# Altium project Control_Board.PrjPcb (part 7 of 7)

## Sheet DC_Link_Sensing.SchDoc
size A4; SheetNumber: 9; SheetTotal: 9
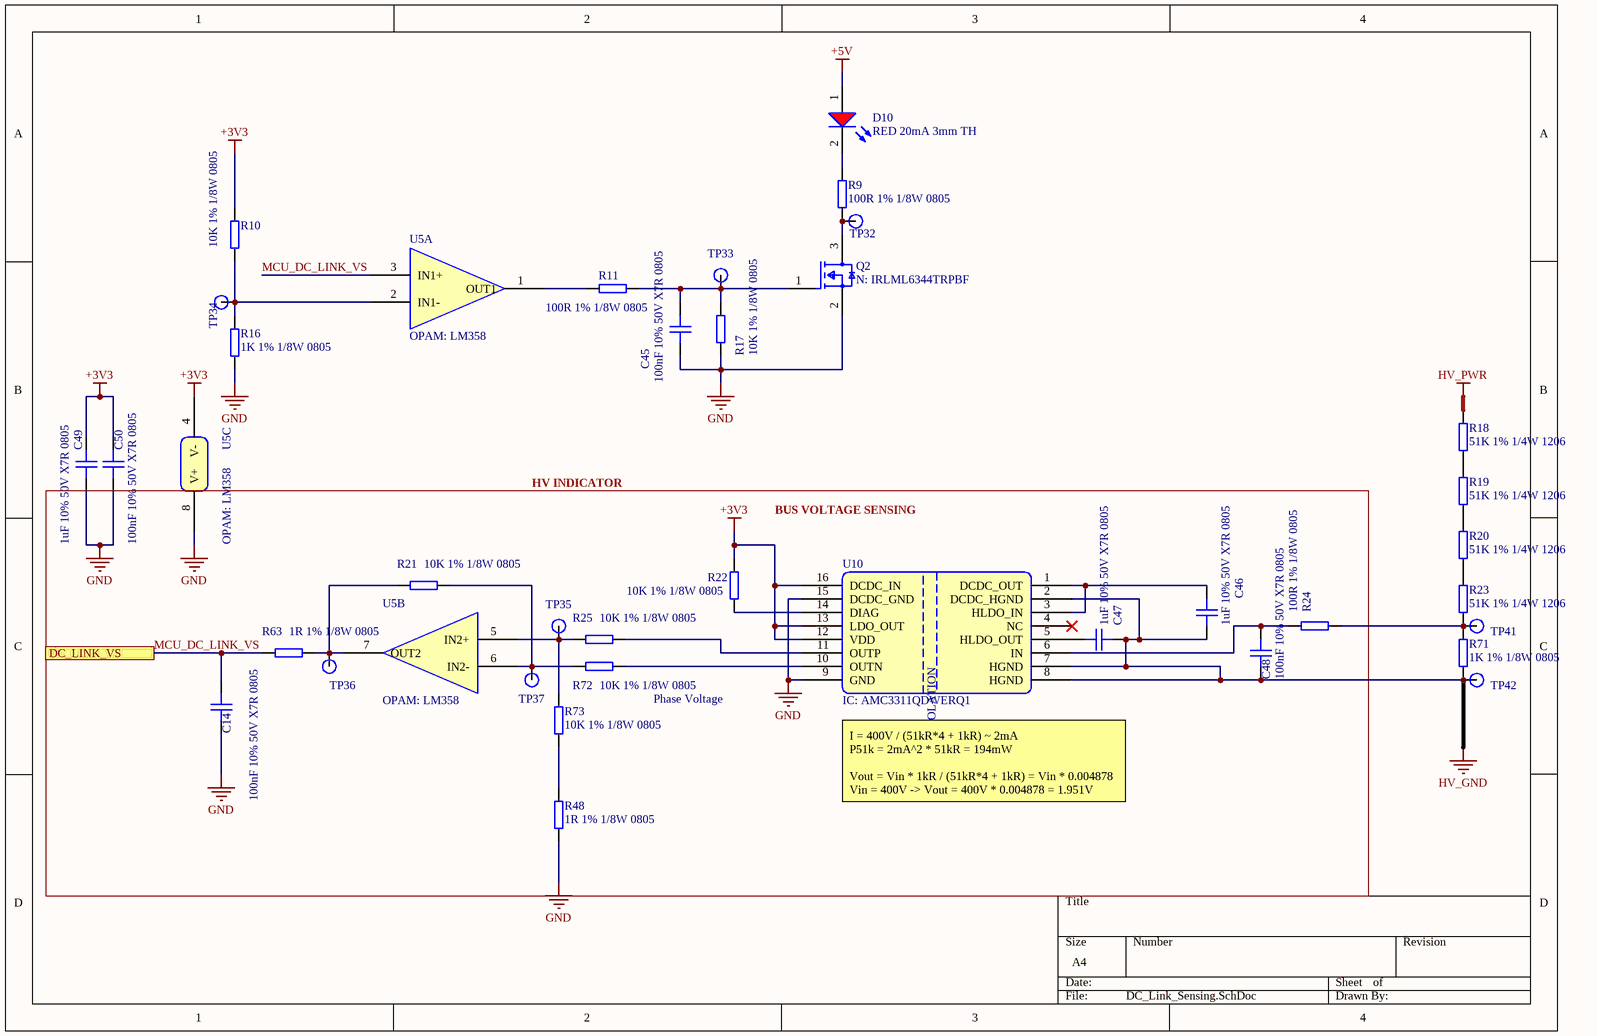
[diagram p8: DC_Link_Sensing.SchDoc]

### Parts
C14  100nF 10% 50V X7R 0805  [CAPC2012X10N]
C45  100nF 10% 50V X7R 0805  [CAPC2012X10N]
C46  1uF 10% 50V X7R 0805  [CAPC2012X10N]
C47  1uF 10% 50V X7R 0805  [CAPC2012X10N]
C48  100nF 10% 50V X7R 0805  [CAPC2012X10N]
C49  1uF 10% 50V X7R 0805  [CAPC2012X10N]
C50  100nF 10% 50V X7R 0805  [CAPC2012X10N]
D10  RED 20mA 3mm TH  [WL-TMRC_D3.95H5.3]
Q2  N: IRLML6344TRPBF  [FP-SOT23-MFG]
R9  100R 1% 1/8W 0805  [RESC2012X05N]
R10  10K 1% 1/8W 0805  [RESC2012X05N]
R11  100R 1% 1/8W 0805  [RESC2012X05N]
R16  1K 1% 1/8W 0805  [RESC2012X05N]
R17  10K 1% 1/8W 0805  [RESC2012X05N]
R18  51K 1% 1/4W 1206  [RESC3116X06N]
R19  51K 1% 1/4W 1206  [RESC3116X06N]
R20  51K 1% 1/4W 1206  [RESC3116X06N]
R21  10K 1% 1/8W 0805  [RESC2012X05N]
R22  10K 1% 1/8W 0805  [RESC2012X05N]
R23  51K 1% 1/4W 1206  [RESC3116X06N]
R24  100R 1% 1/8W 0805  [RESC2012X05N]
R25  10K 1% 1/8W 0805  [RESC2012X05N]
R48  1R 1% 1/8W 0805  [RESC2012X05N]
R63  1R 1% 1/8W 0805  [RESC2012X05N]
R71  1K 1% 1/8W 0805  [RESC2012X05N]
R72  10K 1% 1/8W 0805  [RESC2012X05N]
R73  10K 1% 1/8W 0805  [RESC2012X05N]
TP32  TestPoint  [Test Point-Footprint-1]  (value not drawn)
TP33  TestPoint  [Test Point-Footprint-1]  (value not drawn)
TP34  TestPoint  [Test Point-Footprint-1]  (value not drawn)
TP35  TestPoint  [Test Point-Footprint-1]  (value not drawn)
TP36  TestPoint  [Test Point-Footprint-1]  (value not drawn)
TP37  TestPoint  [Test Point-Footprint-1]  (value not drawn)
TP41  TestPoint  [Test Point-Footprint-1]  (value not drawn)
TP42  TestPoint  [Test Point-Footprint-1]  (value not drawn)
U5  OPAM: LM358  [FP-D0008A-IPC_C]  (parts A,B,C of 3)
U10  IC: AMC3311QDWERQ1  [SOIC127P1030X265-16N]

### Ports
DC_LINK_VS (see Control_Board_SCH[3C], Microcontroller[4B])

### Nets
+3V3: C49.2 C50.2 R10.2 R22.1 U5.4(V-) U10.12(VDD) U10.13(LDO_OUT) U10.16(DCDC_IN)
+5V: D10.1(A)
GND: C14.1 C45.1 C49.1 C50.1 Q2.2(S) R16.1 R17.1 R48.1 U5.8(V+) U10.9(GND) U10.15(DCDC_GND)
HV_GND: C46.1 C47.1 C48.1 R71.1 TP42.1 U10.2(DCDC_HGND) U10.7(HGND) U10.8(HGND)
HV_PWR: R18.2
MCU_DC_LINK_VS: C14.2 R63.1 U5.3(IN1+) ; port DC_LINK_VS
NetC45_2: C45.2 Q2.1(G) R11.2 R17.2 TP33.1
NetC46_2: C46.2 U10.1(DCDC_OUT) U10.3(HLDO_IN)
NetC47_2: C47.2 U10.5(HLDO_OUT)
NetC48_2: C48.2 R24.2 U10.6(IN)
NetD10_2: D10.2(K) R9.2
NetQ2_3: Q2.3(D) R9.1 TP32.1
NetR10_1: R10.1 R16.2 TP34.1 U5.2(IN1-)
NetR11_1: R11.1 U5.1(OUT1)
NetR18_1: R18.1 R19.2
NetR19_1: R19.1 R20.2
NetR20_1: R20.1 R23.2
NetR21_1: R21.1 R63.2 TP36.1 U5.7(OUT2)
NetR21_2: R21.2 R72.1 TP37.1 U5.6(IN2-)
NetR22_2: R22.2 U10.14(DIAG)
NetR23_1: R23.1 R24.1 R71.2 TP41.1
NetR25_1: R25.1 R73.2 TP35.1 U5.5(IN2+)
NetR25_2: R25.2 U10.11(OUTP)
NetR48_2: R48.2 R73.1
NetR72_2: R72.2 U10.10(OUTN)

Not connected (* = marked no-connect by the designer): U10 4(NC)*

### Notes on the sheet
- HV INDICATOR
- BUS VOLTAGE SENSING
- Phase Voltage
- (near U10) I = 400V / (51kR*4 + 1kR) ~ 2mA
  P51k = 2mA^2 * 51kR = 194mW
  Vout = Vin * 1kR / (51kR*4 + 1kR) = Vin * 0.004878
  Vin = 400V -> Vout = 400V * 0.004878 = 1.951V
- (in symbol CMP-001-00097-4) ISOLATION

### Library data of the parts
C14 C45 C48 C50 = CMP-001-00091-1: Multilayer Ceramic Capacitors MLCC - SMD/SMT 50V 0.1uF X7R 0805 10%; Manufacturer: Stackpole Electronics; Manufacturer Part Number: CML0805X7R104KT50V; Voltage Rating (DC): 50V; REACH SVHC: Yes; Height: 800µm; Min Operating Temperature: -55°C; Dielectric Material: Ceramic; RoHS: Compliant; Number of Terminals: 2; Lifecycle Status: Production; Width: 1.25mm; Length: 2mm; Category: Ceramic Capacitors; Max Operating Temperature: 125°C; Mount: Surface Mount; Capacitance: 100nF
C46 C47 C49 = CMP-001-00047-1: Ceramic Capacitor, Multilayer, Ceramic, 50V, 10% +Tol, 10% -Tol, X7R, 15% TC, 1uF, Surface Mount, 0805; Manufacturer Part Number: C2012X7R1H105K125AB; Manufacturer Lifecycle Status: PRODUCTION; Manufacturer: TDK; Value: 1µF; Export Control Classification Number (ECCN) Code: EAR99; Case/Package: 0805; Max Length: 3.5mm; ComponentLink4Description: https://datasheet.octopart.com:443/C3216X7R1H106K160AC-TDK-datasheet-151546523.pdf?src-supplier=ODG+(Origin+Data+Global); ComponentLink1URL: https://datasheet.octopart.com:443/C3216X7R1H106K160AC-TDK-datasheet-175423548.pdf?src-supplier=TME; Category: Ceramic Capacitors; Voltage Rating (DC): 50V; Case Code (Metric): 2012; Lifecycle Status: Production; Height: 1.6mm; Design Item ID: 1uF 10% 50V X7R 0805; Min Length: 3.1mm; Min Operating Temperature: -55°C; Pricing: 100=3,09, 250=2,81, 500=2,35, 1000=2,2, 2000=1,97 (DKK); Width: 1.6mm; Voltage Rating: 50V; Stock: 26276; ComponentLink2Description: https://datasheet.octopart.com:443/C3216X7R1H106K160AC-TDK-datasheet-182135025.pdf?src-supplier=TME; Harmonized Tariff Schedule (HTS) Code: 8532.24.00.20; ComponentLink3Description: https://datasheet.octopart.com:443/C3216X7R1H106K160AC-TDK-datasheet-159617022.pdf?src-supplier=TME; Thickness: 1.6mm; Max Operating Temperature: 125°C; ComponentLink4URL: https://datasheet.octopart.com:443/C3216X7R1H106K160AC-TDK-datasheet-151546523.pdf?src-supplier=ODG+(Origin+Data+Global); Lead Free: Lead Free; ComponentLink3URL: https://datasheet.octopart.com:443/C3216X7R1H106K160AC-TDK-datasheet-159617022.pdf?src-supplier=TME; ComponentLink1Description: https://datasheet.octopart.com:443/C3216X7R1H106K160AC-TDK-datasheet-175423548.pdf?src-supplier=TME; Max Width: 1.9mm; Dielectric: X7R; RoHS: Compliant; China RoHS: Compliant; REACH SVHC: Yes; ComponentLink2URL: https://datasheet.octopart.com:443/C3216X7R1H106K160AC-TDK-datasheet-182135025.pdf?src-supplier=TME; Length: 3.2mm; ComponentLink5URL: https://datasheet.octopart.com/C3216X7R1H106K160AC-TDK-datasheet-41194876.pdf; Introduction Date: 2018-03-29; Dielectric Material: Ceramic; Min Width: 1.5mm; Number of Terminals: 2; Material: Ceramic; Source: MasterLibrary_SCH.SchLib; Mounting Technology: Surface Mount; ComponentLink5Description: https://datasheet.octopart.com/C3216X7R1H106K160AC-TDK-datasheet-41194876.pdf
D10 = CMP-007-00005-2: LED RED DIFFUSED 3MM ROUND T/H; Manufacturer: Wurth Elektronik; Manufacturer Part Number: 151031SS06000; Lens Style: Circular, Diffused, Round; Peak Wavelength: 650nm; Dominant Wavelength: 640nm; Max Reverse Voltage (DC): 5V; Luminous Intensity: 35mcd; Forward Voltage: 2.2V; Forward Current: 100mA; Max Operating Temperature: 85°C; Length: 3mm; Category: LEDs; RoHS: Compliant; Lens Size: 3mm; Height: 5.3mm; Test Current: 20mA; Color: Red; Min Operating Temperature: -40°C; Packaging: Bulk; Case/Package: Radial; Mount: Through Hole; REACH SVHC: Unknown
Q2 = CMP-013-00010-1: N-Channel 30 V 5A (Ta) 1.3W (Ta) Surface Mount Micro3™/SOT-23; Manufacturer: Infineon; Manufacturer Package Identifier: Micro3; Gate to Source Voltage (Vgs): 12V; Drain to Source Voltage (Vdss): 30V; Drain to Source Resistance: 29mΩ; Input Capacitance: 650pF; Fall Time: 9.1ns; Element Configuration: Single; Continuous Drain Current (ID): 5A; Lead Free: Lead Free; Height: 1.12mm; Lifecycle Status: Production; Case/Package: SOT-23; Introduction Date: 2010-10-28; Export Control Classification Number (ECCN) Code: EAR99; Drain to Source Breakdown Voltage: 30V; Category: MOSFETs; Manufacturer Part Number: IRLML6344TRPBF; Country of Origin: Mainland China, UK; Length: 3.04mm; Harmonized Tariff Schedule (HTS) Code: 8541.29.00.95
R9 R11 R24 = CMP-009-00668-1: Res Thick Film 0805 100 Ohm 1% 0.125W ±100ppm/°C Molded SMD Paper T/R; Manufacturer Part Number: RMCF0805FT100R; Manufacturer: Stackpole Electronics; Working Voltage: 150V; Power Rating: 125mW; Value: 100; Features: Automotive AEC-Q200; Lifecycle Status: Production; ComponentLink10URL: https://datasheet.octopart.com:443/RMCF0805FT10K0-Stackpole-Electronics-datasheet-11547379.pdf?src-supplier=Future+Electronics; Case Code (Metric): 2012; ComponentLink16URL: http://sigma.octopart.com:80/141158211/reach_statement/Stackpole-Electronics-RMCF0805FT10K0.pdf?src-supplier=Compliance+Statements; ComponentLink14URL: https://datasheet.octopart.com:443/RMCF0805FT10K0-Stackpole-Electronics-datasheet-5313682.pdf?src-supplier=Future+Electronics; ComponentLink6URL: https://datasheet.octopart.com:443/RMCF0805FT10K0-Stackpole-Electronics-datasheet-62091608.pdf?src-supplier=Stackpole+Electronics; ComponentLink3URL: https://datasheet.octopart.com:443/RMCF0805FT10K0-Stackpole-Electronics-datasheet-28504820.pdf?src-supplier=Upverter; Design Item ID: 100R 1% 1/8W 0805; Mounting Technology: Surface Mount; ComponentLink9URL: https://datasheet.octopart.com:443/RMCF0805FT10K0-Stackpole-Electronics-datasheet-11546843.pdf?src-supplier=Arrow+Electronics; ComponentLink2Description: https://datasheet.octopart.com:443/RMCF0805FT10K0-Stackpole-Electronics-datasheet-12534581.pdf?src-supplier=Upverter; Voltage Rating: 150V; ComponentLink17Description: http://sigma.octopart.com:80/141158212/rohs_statement/Stackpole-Electronics-RMCF0805FT10K0.pdf?src-supplier=Compliance+Statements; Stock: 3420000; Number of Terminations: 2; Contact Plating: Tin; ComponentLink1Description: https://datasheet.octopart.com:443/RMCF0805FT10K0-Stackpole-Electronics-datasheet-182148065.pdf?src-supplier=IHS; ComponentLink2URL: https://datasheet.octopart.com:443/RMCF0805FT10K0-Stackpole-Electronics-datasheet-12534581.pdf?src-supplier=Upverter; Source: MasterLibrary_SCH.SchLib; Length: 2mm; ComponentLink13Description: https://datasheet.octopart.com:443/RMCF0805FT10K0-Stackpole-Electronics-datasheet-8088878.pdf?src-supplier=Future+Electronics; Lead Free: Lead Free; Category: Chip SMD Resistors; Composition: Thick Film; Tolerance: 1%; Schedule B: 8533210045, 8533210045; RoHS: Compliant; ComponentLink15URL: http://sigma.octopart.com:80/15940719/materials_sheet/Stackpole-Electronics-RMCF0805FT10K0.pdf?src-supplier=Compliance+Statements; Case/Package: 0805; Pricing: 5000=0.00245, 10000=0.00241, 20000=0.00238, 40000=0.00234, 80000=0.0023 (USD); ComponentLink8Description: https://datasheet.octopart.com:443/RMCF0805FT10K0-Stackpole-Electronics-datasheet-154799224.pdf?src-supplier=Master+Electronics; ComponentLink11Description: https://datasheet.octopart.com:443/RMCF0805FT10K0-Stackpole-Electronics-datasheet-8359789.pdf?src-supplier=Future+Electronics; China RoHS: Non-Compliant; Height: 500µm; ComponentLink9Description: https://datasheet.octopart.com:443/RMCF0805FT10K0-Stackpole-Electronics-datasheet-11546843.pdf?src-supplier=Arrow+Electronics; ComponentLink8URL: https://datasheet.octopart.com:443/RMCF0805FT10K0-Stackpole-Electronics-datasheet-154799224.pdf?src-supplier=Master+Electronics; ComponentLink12Description: https://datasheet.octopart.com:443/RMCF0805FT10K0-Stackpole-Electronics-datasheet-8324226.pdf?src-supplier=Future+Electronics; Temperature Coefficient: 100ppm/°C; ComponentLink12URL: https://datasheet.octopart.com:443/RMCF0805FT10K0-Stackpole-Electronics-datasheet-8324226.pdf?src-supplier=Future+Electronics; Number of Terminals: 2; Depth: 1.25mm; ComponentLink7Description: https://datasheet.octopart.com:443/RMCF0805FT10K0-Stackpole-Electronics-datasheet-10788263.pdf?src-supplier=Stackpole+Electronics; ComponentLink15Description: http://sigma.octopart.com:80/15940719/materials_sheet/Stackpole-Electronics-RMCF0805FT10K0.pdf?src-supplier=Compliance+Statements; ComponentLink6Description: https://datasheet.octopart.com:443/RMCF0805FT10K0-Stackpole-Electronics-datasheet-62091608.pdf?src-supplier=Stackpole+Electronics; Packaging: Cut Tape (CT); Max Operating Temperature: 155°C; ComponentLink7URL: https://datasheet.octopart.com:443/RMCF0805FT10K0-Stackpole-Electronics-datasheet-10788263.pdf?src-supplier=Stackpole+Electronics; ComponentLink16Description: http://sigma.octopart.com:80/141158211/reach_statement/Stackpole-Electronics-RMCF0805FT10K0.pdf?src-supplier=Compliance+Statements; Width: 1.25mm; Power Dissipation: 125mW; ComponentLink5Description: https://datasheet.octopart.com:443/RMCF0805FT10K0-Stackpole-Electronics-datasheet-141193804.pdf?src-supplier=Stackpole+Electronics; Radiation Hardening: No; Military Standard: Not; Min Operating Temperature: -55°C; ComponentLink11URL: https://datasheet.octopart.com:443/RMCF0805FT10K0-Stackpole-Electronics-datasheet-8359789.pdf?src-supplier=Future+Electronics; ComponentLink3Description: https://datasheet.octopart.com:443/RMCF0805FT10K0-Stackpole-Electronics-datasheet-28504820.pdf?src-supplier=Upverter; REACH SVHC: Yes; ComponentLink4Description: https://datasheet.octopart.com:443/RMCF0805FT10K0-Stackpole-Electronics-datasheet-12510902.pdf?src-supplier=Upverter; ComponentLink10Description: https://datasheet.octopart.com:443/RMCF0805FT10K0-Stackpole-Electronics-datasheet-11547379.pdf?src-supplier=Future+Electronics; ComponentLink5URL: https://datasheet.octopart.com:443/RMCF0805FT10K0-Stackpole-Electronics-datasheet-141193804.pdf?src-supplier=Stackpole+Electronics; Max Power Dissipation: 125mW; ComponentLink13URL: https://datasheet.octopart.com:443/RMCF0805FT10K0-Stackpole-Electronics-datasheet-8088878.pdf?src-supplier=Future+Electronics; ComponentLink17URL: http://sigma.octopart.com:80/141158212/rohs_statement/Stackpole-Electronics-RMCF0805FT10K0.pdf?src-supplier=Compliance+Statements; ComponentLink14Description: https://datasheet.octopart.com:443/RMCF0805FT10K0-Stackpole-Electronics-datasheet-5313682.pdf?src-supplier=Future+Electronics; ComponentLink4URL: https://datasheet.octopart.com:443/RMCF0805FT10K0-Stackpole-Electronics-datasheet-12510902.pdf?src-supplier=Upverter; ComponentLink1URL: https://datasheet.octopart.com:443/RMCF0805FT10K0-Stackpole-Electronics-datasheet-182148065.pdf?src-supplier=IHS
R10 R21 R22 R25 R72 R73 = CMP-009-00659-2: Res Thick Film 0805 10K Ohm 1% 0.125W ±100ppm/°C Molded SMD Paper T/R; Manufacturer: Stackpole Electronics; Manufacturer Part Number: RMCF0805FT10K0; Power Dissipation: 125mW; Voltage Rating: 150V; Design Item ID: 10K 1% 1/4W 0805; ComponentLink15URL: http://sigma.octopart.com:80/15940719/materials_sheet/Stackpole-Electronics-RMCF0805FT10K0.pdf?src-supplier=Compliance+Statements; ComponentLink13Description: https://datasheet.octopart.com:443/RMCF0805FT10K0-Stackpole-Electronics-datasheet-8088878.pdf?src-supplier=Future+Electronics; Depth: 1.25mm; Number of Terminations: 2; ComponentLink12Description: https://datasheet.octopart.com:443/RMCF0805FT10K0-Stackpole-Electronics-datasheet-8324226.pdf?src-supplier=Future+Electronics; ComponentLink9URL: https://datasheet.octopart.com:443/RMCF0805FT10K0-Stackpole-Electronics-datasheet-11546843.pdf?src-supplier=Arrow+Electronics; ComponentLink4Description: https://datasheet.octopart.com:443/RMCF0805FT10K0-Stackpole-Electronics-datasheet-12510902.pdf?src-supplier=Upverter; China RoHS: Non-Compliant; Contact Plating: Tin; ComponentLink7URL: https://datasheet.octopart.com:443/RMCF0805FT10K0-Stackpole-Electronics-datasheet-10788263.pdf?src-supplier=Stackpole+Electronics; ComponentLink6Description: https://datasheet.octopart.com:443/RMCF0805FT10K0-Stackpole-Electronics-datasheet-62091608.pdf?src-supplier=Stackpole+Electronics; ComponentLink4URL: https://datasheet.octopart.com:443/RMCF0805FT10K0-Stackpole-Electronics-datasheet-12510902.pdf?src-supplier=Upverter; ComponentLink12URL: https://datasheet.octopart.com:443/RMCF0805FT10K0-Stackpole-Electronics-datasheet-8324226.pdf?src-supplier=Future+Electronics; ComponentLink1Description: https://datasheet.octopart.com:443/RMCF0805FT10K0-Stackpole-Electronics-datasheet-182148065.pdf?src-supplier=IHS; ComponentLink3URL: https://datasheet.octopart.com:443/RMCF0805FT10K0-Stackpole-Electronics-datasheet-28504820.pdf?src-supplier=Upverter; Width: 1.25mm; Lifecycle Status: Production; ComponentLink15Description: http://sigma.octopart.com:80/15940719/materials_sheet/Stackpole-Electronics-RMCF0805FT10K0.pdf?src-supplier=Compliance+Statements; Max Operating Temperature: 155°C; ComponentLink8URL: https://datasheet.octopart.com:443/RMCF0805FT10K0-Stackpole-Electronics-datasheet-154799224.pdf?src-supplier=Master+Electronics; ComponentLink16URL: http://sigma.octopart.com:80/141158211/reach_statement/Stackpole-Electronics-RMCF0805FT10K0.pdf?src-supplier=Compliance+Statements; ComponentLink3Description: https://datasheet.octopart.com:443/RMCF0805FT10K0-Stackpole-Electronics-datasheet-28504820.pdf?src-supplier=Upverter; ComponentLink10URL: https://datasheet.octopart.com:443/RMCF0805FT10K0-Stackpole-Electronics-datasheet-11547379.pdf?src-supplier=Future+Electronics; Features: Automotive AEC-Q200; Lead Free: Lead Free; ComponentLink2Description: https://datasheet.octopart.com:443/RMCF0805FT10K0-Stackpole-Electronics-datasheet-12534581.pdf?src-supplier=Upverter; ComponentLink14Description: https://datasheet.octopart.com:443/RMCF0805FT10K0-Stackpole-Electronics-datasheet-5313682.pdf?src-supplier=Future+Electronics; ComponentLink17URL: http://sigma.octopart.com:80/141158212/rohs_statement/Stackpole-Electronics-RMCF0805FT10K0.pdf?src-supplier=Compliance+Statements; Stock: 3420000; ComponentLink5URL: https://datasheet.octopart.com:443/RMCF0805FT10K0-Stackpole-Electronics-datasheet-141193804.pdf?src-supplier=Stackpole+Electronics; ComponentLink11URL: https://datasheet.octopart.com:443/RMCF0805FT10K0-Stackpole-Electronics-datasheet-8359789.pdf?src-supplier=Future+Electronics; Max Power Dissipation: 125mW; ComponentLink10Description: https://datasheet.octopart.com:443/RMCF0805FT10K0-Stackpole-Electronics-datasheet-11547379.pdf?src-supplier=Future+Electronics; Case/Package: 0805; ComponentLink8Description: https://datasheet.octopart.com:443/RMCF0805FT10K0-Stackpole-Electronics-datasheet-154799224.pdf?src-supplier=Master+Electronics; Schedule B: 8533210045, 8533210045; Composition: Thick Film; RoHS: Compliant; ComponentLink17Description: http://sigma.octopart.com:80/141158212/rohs_statement/Stackpole-Electronics-RMCF0805FT10K0.pdf?src-supplier=Compliance+Statements; Case Code (Metric): 2012; Number of Terminals: 2; Military Standard: Not; ComponentLink11Description: https://datasheet.octopart.com:443/RMCF0805FT10K0-Stackpole-Electronics-datasheet-8359789.pdf?src-supplier=Future+Electronics; Height: 500µm; Min Operating Temperature: -55°C; Category: Chip SMD Resistors; Value: 10k; Working Voltage: 150V; Source: MasterLibrary_SCH.SchLib; ComponentLink5Description: https://datasheet.octopart.com:443/RMCF0805FT10K0-Stackpole-Electronics-datasheet-141193804.pdf?src-supplier=Stackpole+Electronics; Length: 2mm; ComponentLink16Description: http://sigma.octopart.com:80/141158211/reach_statement/Stackpole-Electronics-RMCF0805FT10K0.pdf?src-supplier=Compliance+Statements; Tolerance: 1%; Temperature Coefficient: 100ppm/°C; Pricing: 5000=0.00245, 10000=0.00241, 20000=0.00238, 40000=0.00234, 80000=0.0023 (USD); REACH SVHC: Yes; Mounting Technology: Surface Mount; Packaging: Cut Tape (CT); ComponentLink9Description: https://datasheet.octopart.com:443/RMCF0805FT10K0-Stackpole-Electronics-datasheet-11546843.pdf?src-supplier=Arrow+Electronics; Power Rating: 125mW; ComponentLink13URL: https://datasheet.octopart.com:443/RMCF0805FT10K0-Stackpole-Electronics-datasheet-8088878.pdf?src-supplier=Future+Electronics; ComponentLink2URL: https://datasheet.octopart.com:443/RMCF0805FT10K0-Stackpole-Electronics-datasheet-12534581.pdf?src-supplier=Upverter; ComponentLink1URL: https://datasheet.octopart.com:443/RMCF0805FT10K0-Stackpole-Electronics-datasheet-182148065.pdf?src-supplier=IHS; ComponentLink7Description: https://datasheet.octopart.com:443/RMCF0805FT10K0-Stackpole-Electronics-datasheet-10788263.pdf?src-supplier=Stackpole+Electronics; Radiation Hardening: No; ComponentLink6URL: https://datasheet.octopart.com:443/RMCF0805FT10K0-Stackpole-Electronics-datasheet-62091608.pdf?src-supplier=Stackpole+Electronics; ComponentLink14URL: https://datasheet.octopart.com:443/RMCF0805FT10K0-Stackpole-Electronics-datasheet-5313682.pdf?src-supplier=Future+Electronics
R16 R71 = CMP-009-00648-1: Res Thick Film 0805 1K Ohm 1% 0.125W ±100ppm/°C Molded SMD Paper T/R; Manufacturer: Stackpole Electronics; Manufacturer Part Number: RMCF0805FT1K00; Power Dissipation: 125mW; Working Voltage: 150V; ComponentLink4Description: https://datasheet.octopart.com:443/RMCF0805FT10K0-Stackpole-Electronics-datasheet-12510902.pdf?src-supplier=Upverter; Tolerance: 1%; ComponentLink7Description: https://datasheet.octopart.com:443/RMCF0805FT10K0-Stackpole-Electronics-datasheet-10788263.pdf?src-supplier=Stackpole+Electronics; Category: Chip SMD Resistors; Pricing: 5000=0.00245, 10000=0.00241, 20000=0.00238, 40000=0.00234, 80000=0.0023 (USD); RoHS: Compliant; Packaging: Cut Tape (CT); Width: 1.25mm; ComponentLink12URL: https://datasheet.octopart.com:443/RMCF0805FT10K0-Stackpole-Electronics-datasheet-8324226.pdf?src-supplier=Future+Electronics; Temperature Coefficient: 100ppm/°C; Lifecycle Status: Production; Mounting Technology: Surface Mount; ComponentLink6Description: https://datasheet.octopart.com:443/RMCF0805FT10K0-Stackpole-Electronics-datasheet-62091608.pdf?src-supplier=Stackpole+Electronics; Number of Terminals: 2; ComponentLink1Description: https://datasheet.octopart.com:443/RMCF0805FT10K0-Stackpole-Electronics-datasheet-182148065.pdf?src-supplier=IHS; REACH SVHC: Yes; ComponentLink4URL: https://datasheet.octopart.com:443/RMCF0805FT10K0-Stackpole-Electronics-datasheet-12510902.pdf?src-supplier=Upverter; Power Rating: 125mW; Value: 1k; ComponentLink13URL: https://datasheet.octopart.com:443/RMCF0805FT10K0-Stackpole-Electronics-datasheet-8088878.pdf?src-supplier=Future+Electronics; ComponentLink10Description: https://datasheet.octopart.com:443/RMCF0805FT10K0-Stackpole-Electronics-datasheet-11547379.pdf?src-supplier=Future+Electronics; ComponentLink12Description: https://datasheet.octopart.com:443/RMCF0805FT10K0-Stackpole-Electronics-datasheet-8324226.pdf?src-supplier=Future+Electronics; ComponentLink2Description: https://datasheet.octopart.com:443/RMCF0805FT10K0-Stackpole-Electronics-datasheet-12534581.pdf?src-supplier=Upverter; Number of Terminations: 2; ComponentLink17URL: http://sigma.octopart.com:80/141158212/rohs_statement/Stackpole-Electronics-RMCF0805FT10K0.pdf?src-supplier=Compliance+Statements; Contact Plating: Tin; ComponentLink9URL: https://datasheet.octopart.com:443/RMCF0805FT10K0-Stackpole-Electronics-datasheet-11546843.pdf?src-supplier=Arrow+Electronics; ComponentLink17Description: http://sigma.octopart.com:80/141158212/rohs_statement/Stackpole-Electronics-RMCF0805FT10K0.pdf?src-supplier=Compliance+Statements; ComponentLink2URL: https://datasheet.octopart.com:443/RMCF0805FT10K0-Stackpole-Electronics-datasheet-12534581.pdf?src-supplier=Upverter; Case Code (Metric): 2012; ComponentLink8Description: https://datasheet.octopart.com:443/RMCF0805FT10K0-Stackpole-Electronics-datasheet-154799224.pdf?src-supplier=Master+Electronics; ComponentLink11Description: https://datasheet.octopart.com:443/RMCF0805FT10K0-Stackpole-Electronics-datasheet-8359789.pdf?src-supplier=Future+Electronics; ComponentLink5Description: https://datasheet.octopart.com:443/RMCF0805FT10K0-Stackpole-Electronics-datasheet-141193804.pdf?src-supplier=Stackpole+Electronics; ComponentLink11URL: https://datasheet.octopart.com:443/RMCF0805FT10K0-Stackpole-Electronics-datasheet-8359789.pdf?src-supplier=Future+Electronics; Height: 500µm; ComponentLink1URL: https://datasheet.octopart.com:443/RMCF0805FT10K0-Stackpole-Electronics-datasheet-182148065.pdf?src-supplier=IHS; Length: 2mm; ComponentLink16Description: http://sigma.octopart.com:80/141158211/reach_statement/Stackpole-Electronics-RMCF0805FT10K0.pdf?src-supplier=Compliance+Statements; ComponentLink6URL: https://datasheet.octopart.com:443/RMCF0805FT10K0-Stackpole-Electronics-datasheet-62091608.pdf?src-supplier=Stackpole+Electronics; Schedule B: 8533210045, 8533210045; ComponentLink14URL: https://datasheet.octopart.com:443/RMCF0805FT10K0-Stackpole-Electronics-datasheet-5313682.pdf?src-supplier=Future+Electronics; Stock: 3420000; ComponentLink14Description: https://datasheet.octopart.com:443/RMCF0805FT10K0-Stackpole-Electronics-datasheet-5313682.pdf?src-supplier=Future+Electronics; Features: Automotive AEC-Q200; China RoHS: Non-Compliant; ComponentLink13Description: https://datasheet.octopart.com:443/RMCF0805FT10K0-Stackpole-Electronics-datasheet-8088878.pdf?src-supplier=Future+Electronics; Voltage Rating: 150V; Radiation Hardening: No; Source: MasterLibrary_SCH.SchLib; ComponentLink8URL: https://datasheet.octopart.com:443/RMCF0805FT10K0-Stackpole-Electronics-datasheet-154799224.pdf?src-supplier=Master+Electronics; Max Operating Temperature: 155°C; Design Item ID: 1K 1% 1/8W 0805; ComponentLink15Description: http://sigma.octopart.com:80/15940719/materials_sheet/Stackpole-Electronics-RMCF0805FT10K0.pdf?src-supplier=Compliance+Statements; ComponentLink5URL: https://datasheet.octopart.com:443/RMCF0805FT10K0-Stackpole-Electronics-datasheet-141193804.pdf?src-supplier=Stackpole+Electronics; ComponentLink15URL: http://sigma.octopart.com:80/15940719/materials_sheet/Stackpole-Electronics-RMCF0805FT10K0.pdf?src-supplier=Compliance+Statements; Lead Free: Lead Free; Case/Package: 0805; Max Power Dissipation: 125mW; ComponentLink10URL: https://datasheet.octopart.com:443/RMCF0805FT10K0-Stackpole-Electronics-datasheet-11547379.pdf?src-supplier=Future+Electronics; ComponentLink7URL: https://datasheet.octopart.com:443/RMCF0805FT10K0-Stackpole-Electronics-datasheet-10788263.pdf?src-supplier=Stackpole+Electronics; Min Operating Temperature: -55°C; ComponentLink9Description: https://datasheet.octopart.com:443/RMCF0805FT10K0-Stackpole-Electronics-datasheet-11546843.pdf?src-supplier=Arrow+Electronics; Depth: 1.25mm; Military Standard: Not; ComponentLink16URL: http://sigma.octopart.com:80/141158211/reach_statement/Stackpole-Electronics-RMCF0805FT10K0.pdf?src-supplier=Compliance+Statements; ComponentLink3URL: https://datasheet.octopart.com:443/RMCF0805FT10K0-Stackpole-Electronics-datasheet-28504820.pdf?src-supplier=Upverter; ComponentLink3Description: https://datasheet.octopart.com:443/RMCF0805FT10K0-Stackpole-Electronics-datasheet-28504820.pdf?src-supplier=Upverter; Composition: Thick Film
R17 = CMP-009-00659-2: Res Thick Film 0805 10K Ohm 1% 0.125W ±100ppm/°C Molded SMD Paper T/R; Manufacturer Part Number: RMCF0805FT10K0; Manufacturer: Stackpole Electronics; Power Rating: 125mW; Working Voltage: 150V; ComponentLink17Description: http://sigma.octopart.com:80/141158212/rohs_statement/Stackpole-Electronics-RMCF0805FT10K0.pdf?src-supplier=Compliance+Statements; Military Standard: Not; ComponentLink2Description: https://datasheet.octopart.com:443/RMCF0805FT10K0-Stackpole-Electronics-datasheet-12534581.pdf?src-supplier=Upverter; Power Dissipation: 125mW; Radiation Hardening: No; Min Operating Temperature: -55°C; Mounting Technology: Surface Mount; Pricing: 5000=0.00245, 10000=0.00241, 20000=0.00238, 40000=0.00234, 80000=0.0023 (USD); ComponentLink9Description: https://datasheet.octopart.com:443/RMCF0805FT10K0-Stackpole-Electronics-datasheet-11546843.pdf?src-supplier=Arrow+Electronics; Temperature Coefficient: 100ppm/°C; Contact Plating: Tin; Number of Terminals: 2; Source: MasterLibrary_SCH.SchLib; ComponentLink16URL: http://sigma.octopart.com:80/141158211/reach_statement/Stackpole-Electronics-RMCF0805FT10K0.pdf?src-supplier=Compliance+Statements; ComponentLink10Description: https://datasheet.octopart.com:443/RMCF0805FT10K0-Stackpole-Electronics-datasheet-11547379.pdf?src-supplier=Future+Electronics; Case/Package: 0805; RoHS: Compliant; ComponentLink14Description: https://datasheet.octopart.com:443/RMCF0805FT10K0-Stackpole-Electronics-datasheet-5313682.pdf?src-supplier=Future+Electronics; Max Power Dissipation: 125mW; ComponentLink7URL: https://datasheet.octopart.com:443/RMCF0805FT10K0-Stackpole-Electronics-datasheet-10788263.pdf?src-supplier=Stackpole+Electronics; Number of Terminations: 2; Tolerance: 1%; Stock: 3420000; ComponentLink3Description: https://datasheet.octopart.com:443/RMCF0805FT10K0-Stackpole-Electronics-datasheet-28504820.pdf?src-supplier=Upverter; REACH SVHC: Yes; ComponentLink7Description: https://datasheet.octopart.com:443/RMCF0805FT10K0-Stackpole-Electronics-datasheet-10788263.pdf?src-supplier=Stackpole+Electronics; ComponentLink4URL: https://datasheet.octopart.com:443/RMCF0805FT10K0-Stackpole-Electronics-datasheet-12510902.pdf?src-supplier=Upverter; Max Operating Temperature: 155°C; Voltage Rating: 150V; ComponentLink9URL: https://datasheet.octopart.com:443/RMCF0805FT10K0-Stackpole-Electronics-datasheet-11546843.pdf?src-supplier=Arrow+Electronics; ComponentLink5URL: https://datasheet.octopart.com:443/RMCF0805FT10K0-Stackpole-Electronics-datasheet-141193804.pdf?src-supplier=Stackpole+Electronics; ComponentLink12URL: https://datasheet.octopart.com:443/RMCF0805FT10K0-Stackpole-Electronics-datasheet-8324226.pdf?src-supplier=Future+Electronics; ComponentLink4Description: https://datasheet.octopart.com:443/RMCF0805FT10K0-Stackpole-Electronics-datasheet-12510902.pdf?src-supplier=Upverter; ComponentLink14URL: https://datasheet.octopart.com:443/RMCF0805FT10K0-Stackpole-Electronics-datasheet-5313682.pdf?src-supplier=Future+Electronics; ComponentLink15URL: http://sigma.octopart.com:80/15940719/materials_sheet/Stackpole-Electronics-RMCF0805FT10K0.pdf?src-supplier=Compliance+Statements; Category: Chip SMD Resistors; Value: 10k; ComponentLink2URL: https://datasheet.octopart.com:443/RMCF0805FT10K0-Stackpole-Electronics-datasheet-12534581.pdf?src-supplier=Upverter; Packaging: Cut Tape (CT); ComponentLink8Description: https://datasheet.octopart.com:443/RMCF0805FT10K0-Stackpole-Electronics-datasheet-154799224.pdf?src-supplier=Master+Electronics; Composition: Thick Film; Height: 500µm; ComponentLink17URL: http://sigma.octopart.com:80/141158212/rohs_statement/Stackpole-Electronics-RMCF0805FT10K0.pdf?src-supplier=Compliance+Statements; ComponentLink6Description: https://datasheet.octopart.com:443/RMCF0805FT10K0-Stackpole-Electronics-datasheet-62091608.pdf?src-supplier=Stackpole+Electronics; ComponentLink11Description: https://datasheet.octopart.com:443/RMCF0805FT10K0-Stackpole-Electronics-datasheet-8359789.pdf?src-supplier=Future+Electronics; ComponentLink10URL: https://datasheet.octopart.com:443/RMCF0805FT10K0-Stackpole-Electronics-datasheet-11547379.pdf?src-supplier=Future+Electronics; ComponentLink1URL: https://datasheet.octopart.com:443/RMCF0805FT10K0-Stackpole-Electronics-datasheet-182148065.pdf?src-supplier=IHS; Features: Automotive AEC-Q200; Width: 1.25mm; ComponentLink13Description: https://datasheet.octopart.com:443/RMCF0805FT10K0-Stackpole-Electronics-datasheet-8088878.pdf?src-supplier=Future+Electronics; ComponentLink12Description: https://datasheet.octopart.com:443/RMCF0805FT10K0-Stackpole-Electronics-datasheet-8324226.pdf?src-supplier=Future+Electronics; ComponentLink3URL: https://datasheet.octopart.com:443/RMCF0805FT10K0-Stackpole-Electronics-datasheet-28504820.pdf?src-supplier=Upverter; ComponentLink8URL: https://datasheet.octopart.com:443/RMCF0805FT10K0-Stackpole-Electronics-datasheet-154799224.pdf?src-supplier=Master+Electronics; ComponentLink13URL: https://datasheet.octopart.com:443/RMCF0805FT10K0-Stackpole-Electronics-datasheet-8088878.pdf?src-supplier=Future+Electronics; Lifecycle Status: Production; China RoHS: Non-Compliant; Schedule B: 8533210045, 8533210045; Lead Free: Lead Free; ComponentLink6URL: https://datasheet.octopart.com:443/RMCF0805FT10K0-Stackpole-Electronics-datasheet-62091608.pdf?src-supplier=Stackpole+Electronics; ComponentLink5Description: https://datasheet.octopart.com:443/RMCF0805FT10K0-Stackpole-Electronics-datasheet-141193804.pdf?src-supplier=Stackpole+Electronics; Case Code (Metric): 2012; ComponentLink15Description: http://sigma.octopart.com:80/15940719/materials_sheet/Stackpole-Electronics-RMCF0805FT10K0.pdf?src-supplier=Compliance+Statements; Depth: 1.25mm; ComponentLink11URL: https://datasheet.octopart.com:443/RMCF0805FT10K0-Stackpole-Electronics-datasheet-8359789.pdf?src-supplier=Future+Electronics; ComponentLink1Description: https://datasheet.octopart.com:443/RMCF0805FT10K0-Stackpole-Electronics-datasheet-182148065.pdf?src-supplier=IHS; Length: 2mm; Design Item ID: 10K 1% 1/4W 0805; ComponentLink16Description: http://sigma.octopart.com:80/141158211/reach_statement/Stackpole-Electronics-RMCF0805FT10K0.pdf?src-supplier=Compliance+Statements
R18-R20 R23 = CMP-009-00669-2: Res Thick Film 1206 51K Ohm 1% 0.25W(1/4W) ±100ppm/C Pad SMD T/R Automotive AEC-Q200; Manufacturer: Stackpole Electronics; Manufacturer Part Number: RMCF1206JT51K0; Power Rating: 250mW; Temperature Coefficient: 100ppm/°C; Tolerance: 5%; Resistance: 51kΩ; Packaging: Cut Tape (CT); Number of Terminations: 2; China RoHS: Non-Compliant; Max Operating Temperature: 155°C; Lifecycle Status: Production; Length: 3.2004mm; RoHS: Compliant; Features: Automotive AEC-Q200; Military Standard: Not; Contact Plating: Tin; REACH SVHC: Yes; Case Code (Metric): 3216; Composition: Thick Film; Category: Chip SMD Resistors; Radiation Hardening: No; Case/Package: 1206; Depth: 1.6mm; Number of Terminals: 2; Height: 550µm; Power Dissipation: 250mW; Max Power Dissipation: 250mW; Min Operating Temperature: -55°C; Schedule B: 8533210045, 8533210045; Case Code (Imperial): 1206; Mount: Surface Mount; Country of Origin: Japan, Mainland China, Taiwan; Introduction Date: 2011-01-07; Export Control Classification Number (ECCN) Code: EAR99; Harmonized Tariff Schedule (HTS) Code: 8533.21.00.30
R48 R63 = CMP-009-00658-1: Res Thick Film 0805 1 Ohm 1% 0.125W ±100ppm/°C Molded SMD Paper T/R; Manufacturer Part Number: RMCF0805FT1R00; Manufacturer: Stackpole Electronics; Voltage Rating: 150V; Max Power Dissipation: 125mW; Value: 1; RoHS: Compliant; ComponentLink13URL: https://datasheet.octopart.com:443/RMCF0805FT10K0-Stackpole-Electronics-datasheet-8088878.pdf?src-supplier=Future+Electronics; Number of Terminations: 2; ComponentLink11URL: https://datasheet.octopart.com:443/RMCF0805FT10K0-Stackpole-Electronics-datasheet-8359789.pdf?src-supplier=Future+Electronics; Case Code (Metric): 2012; Min Operating Temperature: -55°C; ComponentLink2URL: https://datasheet.octopart.com:443/RMCF0805FT10K0-Stackpole-Electronics-datasheet-12534581.pdf?src-supplier=Upverter; ComponentLink14Description: https://datasheet.octopart.com:443/RMCF0805FT10K0-Stackpole-Electronics-datasheet-5313682.pdf?src-supplier=Future+Electronics; Pricing: 5000=0.00245, 10000=0.00241, 20000=0.00238, 40000=0.00234, 80000=0.0023 (USD); Composition: Thick Film; Category: Chip SMD Resistors; Military Standard: Not; Lead Free: Lead Free; ComponentLink17Description: http://sigma.octopart.com:80/141158212/rohs_statement/Stackpole-Electronics-RMCF0805FT10K0.pdf?src-supplier=Compliance+Statements; Height: 500µm; ComponentLink3URL: https://datasheet.octopart.com:443/RMCF0805FT10K0-Stackpole-Electronics-datasheet-28504820.pdf?src-supplier=Upverter; ComponentLink4URL: https://datasheet.octopart.com:443/RMCF0805FT10K0-Stackpole-Electronics-datasheet-12510902.pdf?src-supplier=Upverter; Stock: 3420000; ComponentLink5Description: https://datasheet.octopart.com:443/RMCF0805FT10K0-Stackpole-Electronics-datasheet-141193804.pdf?src-supplier=Stackpole+Electronics; ComponentLink16Description: http://sigma.octopart.com:80/141158211/reach_statement/Stackpole-Electronics-RMCF0805FT10K0.pdf?src-supplier=Compliance+Statements; Mounting Technology: Surface Mount; ComponentLink9URL: https://datasheet.octopart.com:443/RMCF0805FT10K0-Stackpole-Electronics-datasheet-11546843.pdf?src-supplier=Arrow+Electronics; Lifecycle Status: Production; Schedule B: 8533210045, 8533210045; ComponentLink1URL: https://datasheet.octopart.com:443/RMCF0805FT10K0-Stackpole-Electronics-datasheet-182148065.pdf?src-supplier=IHS; Length: 2mm; ComponentLink14URL: https://datasheet.octopart.com:443/RMCF0805FT10K0-Stackpole-Electronics-datasheet-5313682.pdf?src-supplier=Future+Electronics; ComponentLink4Description: https://datasheet.octopart.com:443/RMCF0805FT10K0-Stackpole-Electronics-datasheet-12510902.pdf?src-supplier=Upverter; ComponentLink11Description: https://datasheet.octopart.com:443/RMCF0805FT10K0-Stackpole-Electronics-datasheet-8359789.pdf?src-supplier=Future+Electronics; ComponentLink8Description: https://datasheet.octopart.com:443/RMCF0805FT10K0-Stackpole-Electronics-datasheet-154799224.pdf?src-supplier=Master+Electronics; Number of Terminals: 2; ComponentLink13Description: https://datasheet.octopart.com:443/RMCF0805FT10K0-Stackpole-Electronics-datasheet-8088878.pdf?src-supplier=Future+Electronics; Packaging: Cut Tape (CT); Power Rating: 125mW; ComponentLink17URL: http://sigma.octopart.com:80/141158212/rohs_statement/Stackpole-Electronics-RMCF0805FT10K0.pdf?src-supplier=Compliance+Statements; ComponentLink10Description: https://datasheet.octopart.com:443/RMCF0805FT10K0-Stackpole-Electronics-datasheet-11547379.pdf?src-supplier=Future+Electronics; ComponentLink6URL: https://datasheet.octopart.com:443/RMCF0805FT10K0-Stackpole-Electronics-datasheet-62091608.pdf?src-supplier=Stackpole+Electronics; ComponentLink16URL: http://sigma.octopart.com:80/141158211/reach_statement/Stackpole-Electronics-RMCF0805FT10K0.pdf?src-supplier=Compliance+Statements; ComponentLink15Description: http://sigma.octopart.com:80/15940719/materials_sheet/Stackpole-Electronics-RMCF0805FT10K0.pdf?src-supplier=Compliance+Statements; China RoHS: Non-Compliant; ComponentLink6Description: https://datasheet.octopart.com:443/RMCF0805FT10K0-Stackpole-Electronics-datasheet-62091608.pdf?src-supplier=Stackpole+Electronics; ComponentLink8URL: https://datasheet.octopart.com:443/RMCF0805FT10K0-Stackpole-Electronics-datasheet-154799224.pdf?src-supplier=Master+Electronics; Working Voltage: 150V; ComponentLink5URL: https://datasheet.octopart.com:443/RMCF0805FT10K0-Stackpole-Electronics-datasheet-141193804.pdf?src-supplier=Stackpole+Electronics; Case/Package: 0805; ComponentLink15URL: http://sigma.octopart.com:80/15940719/materials_sheet/Stackpole-Electronics-RMCF0805FT10K0.pdf?src-supplier=Compliance+Statements; Power Dissipation: 125mW; ComponentLink7URL: https://datasheet.octopart.com:443/RMCF0805FT10K0-Stackpole-Electronics-datasheet-10788263.pdf?src-supplier=Stackpole+Electronics; REACH SVHC: Yes; ComponentLink1Description: https://datasheet.octopart.com:443/RMCF0805FT10K0-Stackpole-Electronics-datasheet-182148065.pdf?src-supplier=IHS; Source: MasterLibrary_SCH.SchLib; Radiation Hardening: No; ComponentLink3Description: https://datasheet.octopart.com:443/RMCF0805FT10K0-Stackpole-Electronics-datasheet-28504820.pdf?src-supplier=Upverter; Contact Plating: Tin; ComponentLink12URL: https://datasheet.octopart.com:443/RMCF0805FT10K0-Stackpole-Electronics-datasheet-8324226.pdf?src-supplier=Future+Electronics; ComponentLink10URL: https://datasheet.octopart.com:443/RMCF0805FT10K0-Stackpole-Electronics-datasheet-11547379.pdf?src-supplier=Future+Electronics; Max Operating Temperature: 155°C; ComponentLink9Description: https://datasheet.octopart.com:443/RMCF0805FT10K0-Stackpole-Electronics-datasheet-11546843.pdf?src-supplier=Arrow+Electronics; Temperature Coefficient: 100ppm/°C; Width: 1.25mm; Depth: 1.25mm; Tolerance: 1%; ComponentLink12Description: https://datasheet.octopart.com:443/RMCF0805FT10K0-Stackpole-Electronics-datasheet-8324226.pdf?src-supplier=Future+Electronics; Design Item ID: 1R 1% 1/8W 0805; ComponentLink7Description: https://datasheet.octopart.com:443/RMCF0805FT10K0-Stackpole-Electronics-datasheet-10788263.pdf?src-supplier=Stackpole+Electronics; ComponentLink2Description: https://datasheet.octopart.com:443/RMCF0805FT10K0-Stackpole-Electronics-datasheet-12534581.pdf?src-supplier=Upverter; Features: Automotive AEC-Q200
TP32-TP37 TP41 TP42 = CMP-002-00584-1
U5 = CMP-001-00098-1: Dual, 30-V, 700-kHz, 3-mV offset voltage operational amplifier 8-SOIC 0 to 70; Manufacturer: Texas Instruments; Manufacturer Lifecycle Status: ACTIVE; Manufacturer Part Number: LM358BAIDR; Max Dual Supply Voltage: 15V; Voltage Gain: 100dB; Number of Elements: 2; Response Time: 4µs; Gain Bandwidth Product: 700kHz; Max Supply Voltage: 30V; Operating Supply Current: 1mA; Bandwidth: 1.2MHz; Common Mode Rejection Ratio: 65dB; Slew Rate: 0.3V/µs; Operating Supply Voltage: 16V; Input Offset Voltage (Vos): 2mV; Output Current per Channel: -60mA; Max Junction Temperature (Tj): 150°C; Output Current: 30mA; Dual Supply Voltage: 9V; Min Dual Supply Voltage: 1.5V; Input Bias Current: -15nA; Nominal Supply Current: 350µA; Min Supply Voltage: 3V; Pins: 8; Mounting Technology: Surface Mount; RoHS: Compliant; Number of Channels: 2; Lead Free: Lead Free; Number of Circuits: 2; Packaging: Tape & Reel; Thickness: 1.58mm; Schedule B: 8542330000, 8542330000; Lifecycle Status: Production; Case/Package: SOIC; Height: 1.75mm; Number of Amplifiers: 2; Number of Pins: 8; Max Operating Temperature: 70°C; REACH SVHC: No; Ambient Temperature Range High: 70°C; Category: Amplifiers - Op Amps, Buffer, Instrumentation; Width: 3.91mm; Min Operating Temperature: 0°C; Radiation Hardening: No; Length: 4.9mm; PartId: 1
U10 = CMP-001-00097-4: Automotive, 0 to 2-V input, precision reinforced isolated amplifier with integrated DC/DC converter 16-SOIC -40 to 125; Manufacturer: Texas Instruments; Manufacturer Lifecycle Status: ACTIVE; Input Bias Current: 3.5nA; Number of Channels: 1; Input Offset Voltage (Vos): 100µV; Min Supply Voltage: 3V; Output Current per Channel: 14mA; Response Time: 600µs; Bandwidth: 275kHz; Max Junction Temperature (Tj): 150°C; Max Supply Voltage: 5.5V; Category: Linear ICs; Number of Pins: 16; Width: 7.5mm; Thickness: 2.35mm; Length: 10.3mm; Height: 2.65mm; Min Operating Temperature: -40°C; Lifecycle Status: Production; Max Operating Temperature: 125°C; RoHS: Compliant; Manufacturer Part Number: AMC3311QDWERQ1; Ambient Temperature Range High: 125°C; Pins: 16

## Nets that join several sheets
+3V3: Power (6 pins), Microcontroller (C22.1 C23.1 J1.1 J1.41), SEN1 (14 pins), SEN2 (14 pins), SEN3 (14 pins), DC_Link_Sensing (8 pins)
+5V: Control_Board_SCH (R46.1), Power (8 pins), GD1 (7 pins), GD1/GP (C11_Designator1.2 C18_Designator1.2 MOD2_Designator1.1 MOD3_Designator1.1), GD2 (7 pins), GD2/GP (C11_Designator2.2 C18_Designator2.2 MOD2_Designator2.1 MOD3_Designator2.1), GD3 (7 pins), GD3/GP (C11_Designator3.2 C18_Designator3.2 MOD2_Designator3.1 MOD3_Designator3.1), DC_Link (C44.2 R12.1), DC_Link_Sensing (D10.1)
+5V_AUX: Control_Board_SCH (R46.2), Microcontroller (C25.1 C38.1 J1.21 J1.61)
GND: Control_Board_SCH (J16.1), Power (11 pins), Microcontroller (9 pins), GD1 (11 pins), GD1/GP (C11_Designator1.1 C18_Designator1.1 MOD2_Designator1.2 MOD3_Designator1.2), GD2 (11 pins), GD2/GP (C11_Designator2.1 C18_Designator2.1 MOD2_Designator2.2 MOD3_Designator2.2), GD3 (11 pins), GD3/GP (C11_Designator3.1 C18_Designator3.1 MOD2_Designator3.2 MOD3_Designator3.2), SEN1 (15 pins), SEN2 (15 pins), SEN3 (15 pins), DC_Link (C21.1 C44.1 Q1.2 R14.1), DC_Link_Sensing (11 pins)
HV_GND: Control_Board_SCH (J8.1), GD1 (5 pins), GD1/GP (5 pins), GD2 (5 pins), GD2/GP (5 pins), GD3 (5 pins), GD3/GP (5 pins), SEN1 (9 pins), SEN2 (9 pins), SEN3 (9 pins), DC_Link (5 pins), DC_Link_Sensing (8 pins)
HV_PWR: Control_Board_SCH (J7.1), GD1 (D5_GD1.1 J13_GD1.1 J13_GD1.2), GD2 (D5_GD2.1 J13_GD2.1 J13_GD2.2), GD3 (D5_GD3.1 J13_GD3.1 J13_GD3.2), SEN1 (J9_SEN1.1), SEN2 (J9_SEN2.1), SEN3 (J9_SEN3.1), DC_Link (5 pins), DC_Link_Sensing (R18.2)
BLEEDER_DIS: Microcontroller (J1.2), DC_Link (R13.1)
GD~{_FLT}1: Microcontroller (J1.59), GD1 (R3_GD1.1 TP11_GD1.1 U2_GD1.13 U3_GD1.13)
GD~{_FLT}2: Microcontroller (J1.58), GD2 (R3_GD2.1 TP11_GD2.1 U2_GD2.13 U3_GD2.13)
GD~{_FLT}3: Microcontroller (J1.57), GD3 (R3_GD3.1 TP11_GD3.1 U2_GD3.13 U3_GD3.13)
GD_EN: Microcontroller (R4.2), GD1 (R2_GD1.2 TP12_GD1.1 U2_GD1.14 U3_GD1.14)
GD_EN: Microcontroller (R5.2), GD2 (R2_GD2.2 TP12_GD2.1 U2_GD2.14 U3_GD2.14)
GD_EN: Microcontroller (R6.2), GD3 (R2_GD3.2 TP12_GD3.1 U2_GD3.14 U3_GD3.14)
GD_HS_PWM: Microcontroller (J1.39), GD1 (R56_GD1.1)
GD_HS_PWM: Microcontroller (J1.37), GD2 (R56_GD2.1)
GD_HS_PWM: Microcontroller (J1.35), GD3 (R56_GD3.1)
GD_HS_TEMP: Microcontroller (J1.24), GD1 (C41_GD1.2 R61_GD1.1 TP8_GD1.1)
GD_HS_TEMP: Microcontroller (J1.64), GD2 (C41_GD2.2 R61_GD2.1 TP8_GD2.1)
GD_HS_TEMP: Microcontroller (J1.67), GD3 (C41_GD3.2 R61_GD3.1 TP8_GD3.1)
GD_LS_PWM: Microcontroller (J1.40), GD1 (R65_GD1.1)
GD_LS_PWM: Microcontroller (J1.38), GD2 (R65_GD2.1)
GD_LS_PWM: Microcontroller (J1.36), GD3 (R65_GD3.1)
GD_LS_TEMP: Microcontroller (J1.23), GD1 (C43_GD1.2 R70_GD1.1 TP16_GD1.1)
GD_LS_TEMP: Microcontroller (J1.27), GD3 (C43_GD3.2 R70_GD3.1 TP16_GD3.1)
GD_LS_TEMP: Microcontroller (J1.63), GD2 (C43_GD2.2 R70_GD2.1 TP16_GD2.1)
HB_PH_CS: Microcontroller (J1.29), SEN2 (D2_SEN2.4 R30_SEN2.1)
HB_PH_CS: Microcontroller (J1.30), SEN1 (D2_SEN1.4 R30_SEN1.1)
HB_PH_CS: Microcontroller (J1.66), SEN3 (D2_SEN3.4 R30_SEN3.1)
HB_PH_VS: Microcontroller (J1.25), SEN1 (C13_SEN1.2 D2_SEN1.1 R38_SEN1.1)
HB_PH_VS: Microcontroller (J1.65), SEN2 (C13_SEN2.2 D2_SEN2.1 R38_SEN2.1)
HB_PH_VS: Microcontroller (J1.68), SEN3 (C13_SEN3.2 D2_SEN3.1 R38_SEN3.1)
MCU_DC_LINK_VS: Microcontroller (J1.28), DC_Link_Sensing (C14.2 R63.1 U5.3)
NetF1_1: Control_Board_SCH (J14.1), Power (F1.1)
NetF2_1: Control_Board_SCH (J15.1), Power (F2.1)
SW_GD1: GD1 (8 pins), GD1/GP (5 pins)
SW_GD2: GD2 (8 pins), GD2/GP (5 pins)
SW_GD3: GD3 (8 pins), GD3/GP (5 pins)
VDD_HS_GD_HB_GD1: GD1 (U2_GD1.5), GD1/GP (C9_Designator1.2 C10_Designator1.2 MOD2_Designator1.7)
VDD_HS_GD_HB_GD2: GD2 (U2_GD2.5), GD2/GP (C9_Designator2.2 C10_Designator2.2 MOD2_Designator2.7)
VDD_HS_GD_HB_GD3: GD3 (U2_GD3.5), GD3/GP (C9_Designator3.2 C10_Designator3.2 MOD2_Designator3.7)
VDD_LS_GD_HB_GD1: GD1 (U3_GD1.5), GD1/GP (C16_Designator1.2 C17_Designator1.2 MOD3_Designator1.7)
VDD_LS_GD_HB_GD2: GD2 (U3_GD2.5), GD2/GP (C16_Designator2.2 C17_Designator2.2 MOD3_Designator2.7)
VDD_LS_GD_HB_GD3: GD3 (U3_GD3.5), GD3/GP (C16_Designator3.2 C17_Designator3.2 MOD3_Designator3.7)
VEE_HS_GD_HB_GD1: GD1 (U2_GD1.8), GD1/GP (C15_Designator1.1 C35_GD1_GP.1 MOD2_Designator1.5)
VEE_HS_GD_HB_GD2: GD2 (U2_GD2.8), GD2/GP (C15_Designator2.1 C35_GD2_GP.1 MOD2_Designator2.5)
VEE_HS_GD_HB_GD3: GD3 (U2_GD3.8), GD3/GP (C15_Designator3.1 C35_GD3_GP.1 MOD2_Designator3.5)
VEE_LS_GD_HB_GD1: GD1 (U3_GD1.8), GD1/GP (C21_Designator1.1 C22_Designator1.1 MOD3_Designator1.5)
VEE_LS_GD_HB_GD2: GD2 (U3_GD2.8), GD2/GP (C21_Designator2.1 C22_Designator2.1 MOD3_Designator2.5)
VEE_LS_GD_HB_GD3: GD3 (U3_GD3.8), GD3/GP (C21_Designator3.1 C22_Designator3.1 MOD3_Designator3.5)